# EAGLE design ssr-breakout2 (EAGLE 6.5.0)
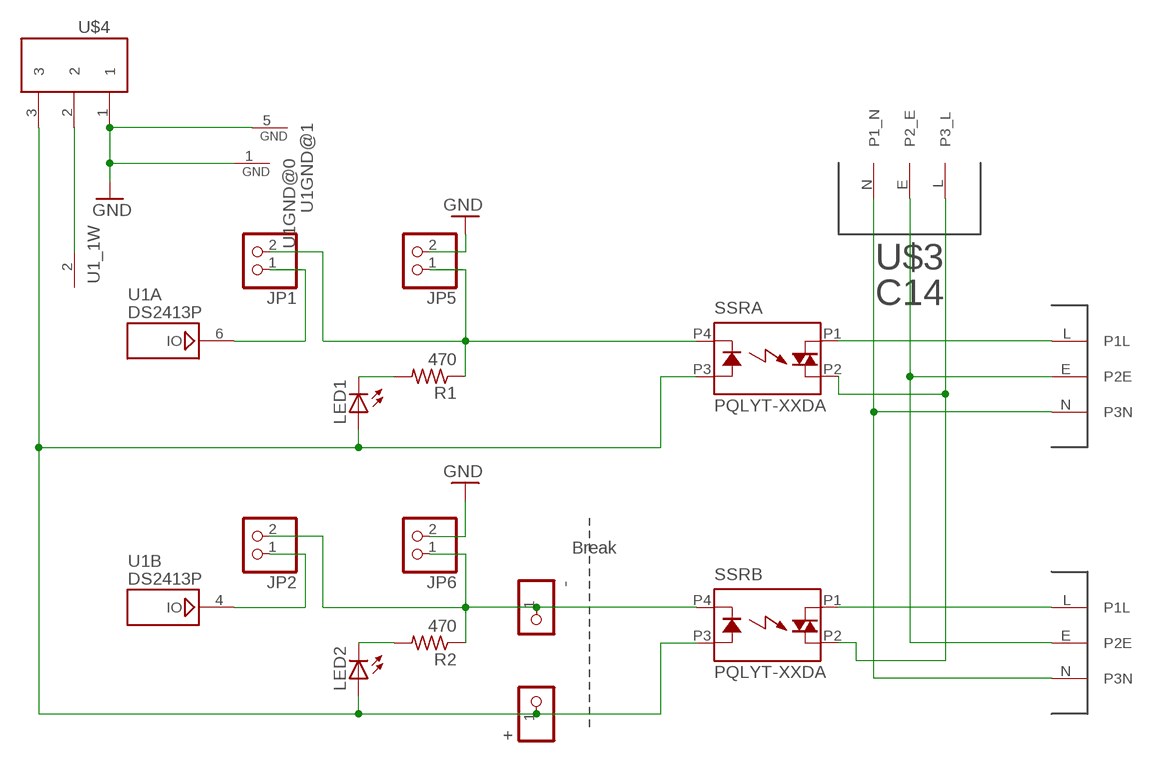
[diagram p0: schematic, sheet 1]

## Parts
+  PINHD-1X1CB  [1X01-CLEANBIG]
-  PINHD-1X1CB  [1X01-CLEANBIG]
JP1  PINHD-1X2  [1X02]
JP2  PINHD-1X2  [1X02]
JP5  PINHD-1X2  [1X02]
JP6  PINHD-1X2  [1X02]
LED1  LEDCHIPLED_0805  [CHIPLED_0805]
LED2  LEDCHIPLED_0805  [CHIPLED_0805]
R1  470  R-US_R0805  [R0805]
R2  470  R-US_R0805  [R0805]
SSRA  PQLYT-XXDA  [PQLYT]
SSRB  PQLYT-XXDA  [PQLYT]
U1  DS2413P  [TSOC6]
U$3  C14  [6ESRM-P]
U$4  3.5MM3PHORIZONTAL  [3.5MM3P]
U$5  C13  [PX0695/10/PC]
U$6  C13  [PX0695/10/PC]

## Nets
GND: JP5.2 JP6.2 U1.1 U1.5 U$4.1
N$2: LED1.C R1.2
N$3: LED2.C R2.2
N$4: -.1 JP2.2 JP6.1 R2.1 SSRB.P4(K)
N$5: +.1 LED1.A LED2.A SSRA.P3(A) SSRB.P3(A) U$4.3
N$6: SSRA.P1(DS1) U$5.L(P1L)
N$7: SSRA.P2(DS2) SSRB.P2(DS2) U$3.L(P3_L)
N$8: U1.2 U$4.2
N$9: U$3.E(P2_E) U$5.E(P2E) U$6.E(P2E)
N$10: SSRB.P1(DS1) U$6.L(P1L)
N$11: JP1.1 U1.6
N$12: JP2.1 U1.4
N$13: U$3.N(P1_N) U$5.N(P3N) U$6.N(P3N)
N$14: JP1.2 JP5.1 R1.1 SSRA.P4(K)

## Notes on the sheet
- Break

## Library data of the parts
+ - = adafruit:PINHD-1X1: Pin header 1x1 for 0.1" spacing With round pins
JP1 JP2 JP5 JP6 = pinhead:PINHD-1X2: PIN HEADER
LED1 LED2 = adafruit:LED: LED OSRAM: - CHIPLED LG R971, LG N971, LY N971, LG Q971, LY Q971, LO R971, LY R971 LH N974, LH R974 LS Q976, LO Q976, LY Q976 LO Q996 - Hyper CHIPLED LW Q18S LB Q993, LB Q99A, LB R99A - SideLED LS A670, LO A670, LY A670, LG A670, LP A670 LB A673, LV A673, LT A673, LW A673 LH A674 LY A675 LS A676, LA A676, LO A676, LY A676, LW A676 LS A679, LY A679, LG A679 - Hyper Micro SIDELED® LS Y876, LA Y876, LO Y876, LY Y876 LT Y87S - SmartLED LW L88C, LW L88S LB L89C, LB L89S, LG L890 LS L89K, LO L89K, LY L89K LS L896, LA L896, LO L896, LY L896 - TOPLED LS T670, LO T670, LY T670, LG T670, LP T670 LSG T670, LSP T670, LSY T670, LOP T670, LYG T670 LG T671, LOG T671, LSG T671 LB T673, LV T673, LT T673, LW T673 LH T674 LS T676, LA T676, LO T676, LY T676, LB T676, LH T676, LSB T676, LW T676 LB T67C, LV T67C, LT T67C, LS T67K, LO T67K, LY T67K, LW E67C LS E67B, LA E67B, LO E67B, LY E67B, LB E67C, LV E67C, LT E67C LW T67C LS T679, LY T679, LG T679 LS T770, LO T770, LY T770, LG T770, LP T770 LB T773, LV T773, LT T773, LW T773 LH T774 LS E675, LA E675, LY E675, LS T675 LS T776, LA T776, LO T776, LY T776, LB T776 LHGB T686 LT T68C, LB T68C - Hyper Mini TOPLED® LB M676 - Mini TOPLED Santana® LG M470 LS M47K, LO M47K, LY M47K Source: http://www.osram.convergy.de/
R1 R2 = adafruit:R-US_: RESISTOR, American symbol
SSRA SSRB = brewpi:PQLYT-XXDA
U1 = 1wire:DS2413: Dual Channel Addressable Switch This chip is similar to the DS2405 chip, but provides two PIO channels with 20mA sinking capability and an on-resistance of 20Ohm for each open drain output. Up to 28V can be switched. Note: Both GND pins must be connected to 0V. Author: Jan Kandziora <jjj@gmx.de>
U$3 = brewpi:C14
U$4 = elcojacobs:3.5MM3P
U$5 U$6 = brewpi:C13

## Board
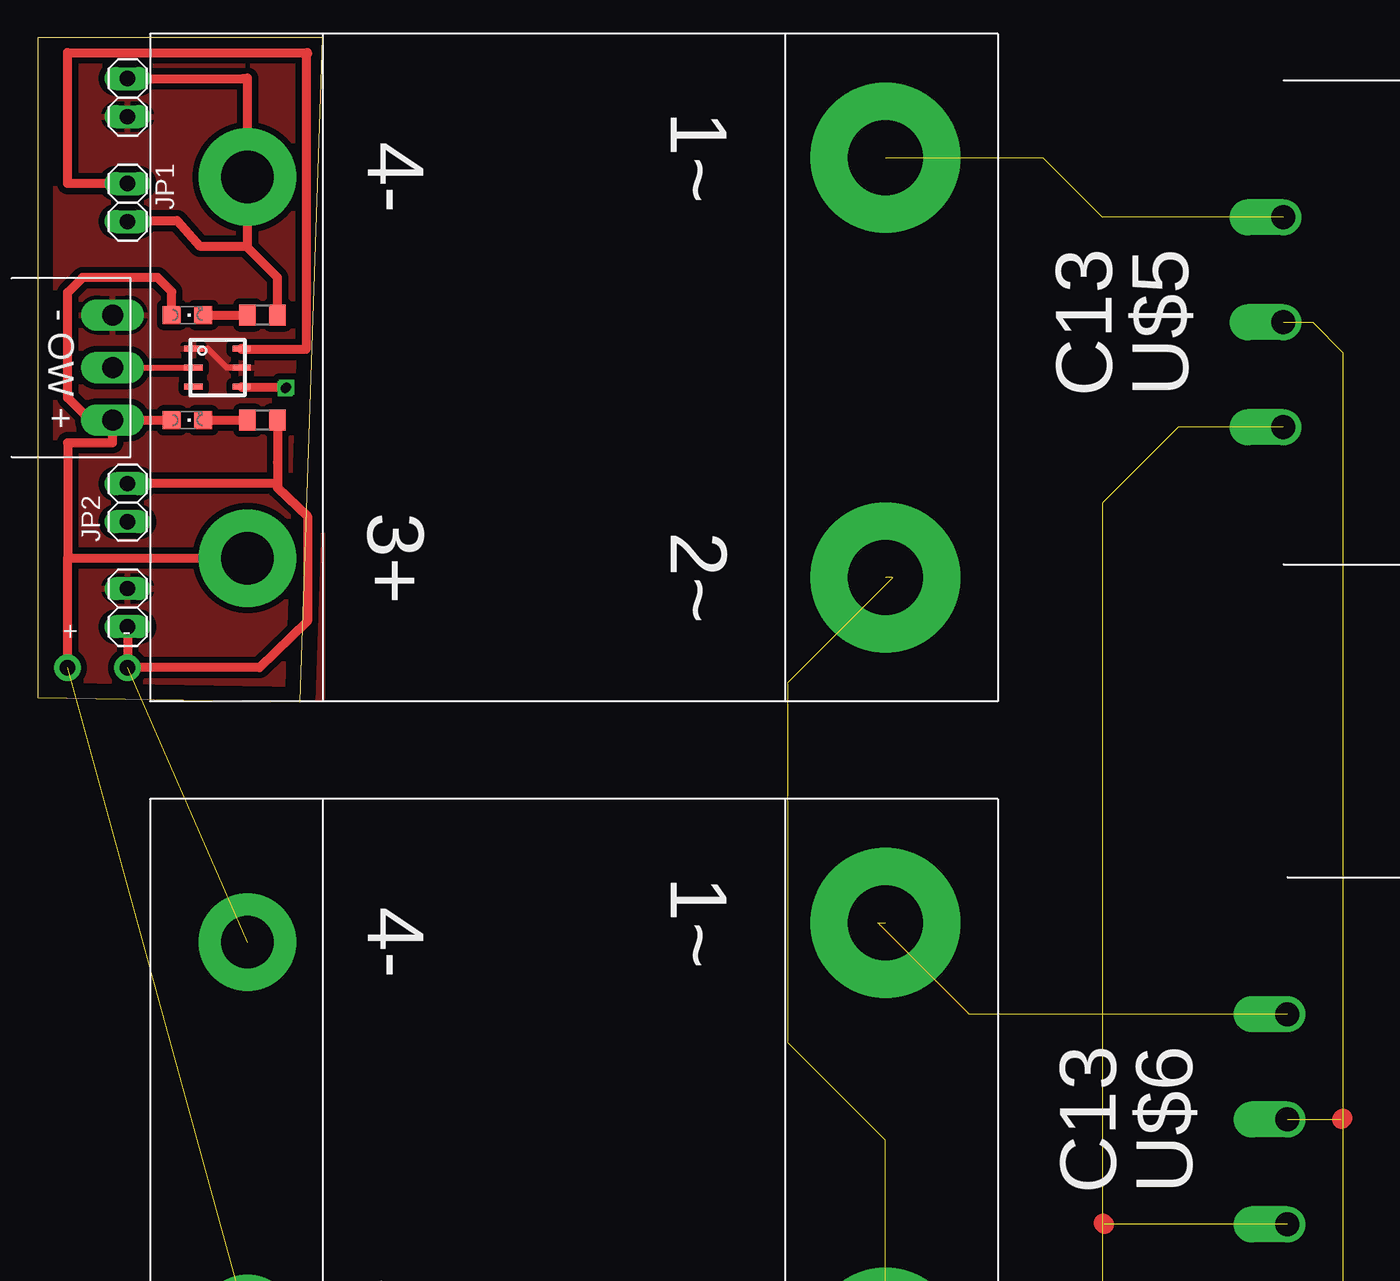
[diagram p1: board, top side]
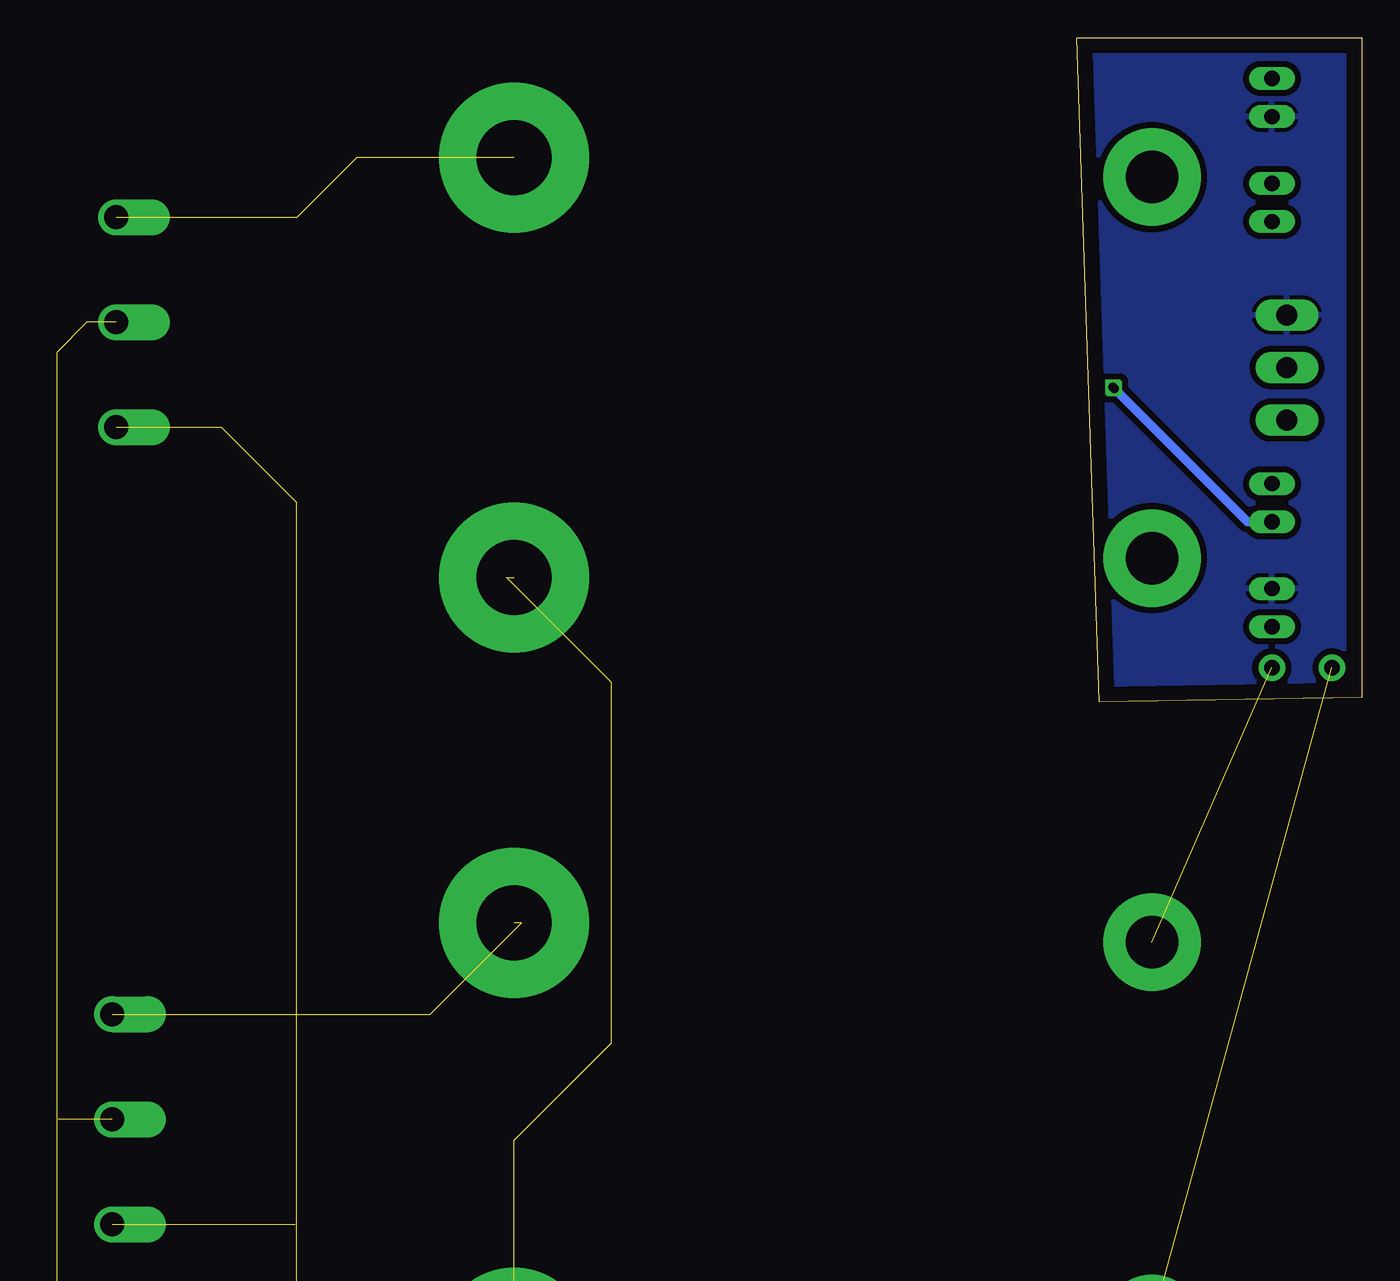
[diagram p2: board, bottom side, seen from below]

Size 19 x 44.3 mm. Coordinates in mm from the lower left corner, seen from the top.
Outline: 0,0.3 17.5,0 19,44.3 0,44.3 0,0.3
Copper layers (1*16): Top 0.035mm / dielectric 1.5mm / Bottom 0.035mm
Design rules "default": minimum track width 10mil, minimum drill 24mil, track to track 8mil, track to pad 8mil, pad to pad 8mil, via to via 8mil, smd to smd 8mil, copper to edge 40mil, drill to drill 8mil, minimum pad ring 10mil, minimum via ring 8mil, stop-mask expansion 4mil, vias tented up to drill 0mil, thermal gap 10mil

### Footprints (pad centres in the part's own frame; a part is rotated, then mirrored left to right if it is on the bottom)
1X01-CLEANBIG = drill 1.016 pad 1.778: 1 0,0
1X02 = drill 1.016 long: 1 -1.27,0; 2 1.27,0
CHIPLED_0805 = smd 1.2 x 1.2: A 0,-1.05; C 0,1.05
R0805 = smd 1.1 x 1.4: 1 -1,0; 2 1,0
PQLYT = drill 5 pad 10: P1 42.5,14; P2 42.5,-14 | drill 3.5 pad 6.5: P3 0,-12.7; P4 0,12.7
TSOC6 = smd 0.406 x 1.219: 1 -1.27,-1.6; 2 0,-1.6; 3 1.27,-1.6; 4 1.27,1.6; 5 0,1.6; 6 -1.27,1.6
6ESRM-P = drill 1.6 pad 3.81: E 0,0; L 9.144,0; N -9.144,0 | hole 3.404: 20.003,9.652; -20.003,9.652
3.5MM3P = drill 1.4 long: 1 -3.5,0; 2 0,0; 3 3.5,0
PX0695/10/PC = drill 1.6 offset: E 0,0; L -7,0; N 7,0

### Placement (x,y rotation side)
+  2,2.3 0 top
-  6,2.3 0 top
JP1  6,33.3 270 top
JP2  6,13.3 90 top
JP5  6,40.3 270 top
JP6  6,6.3 90 top
LED1  10,25.8 270 top
LED2  10,18.8 270 top
R1  15,25.8 180 top
R2  15,18.8 180 top
SSRA  14,22.3 0 top
SSRB  14,-28.7 0 top  (outside the outline)
U1  12,22.3 270 top
U$3  61.86,-60.16 180 top  (outside the outline)
U$4  5,22.3 270 top
U$5  83.03,25.32 270 top  (outside the outline)
U$6  83.3,-27.8 270 top  (outside the outline)

### Tracks (layer width: path | path; a pad name or v marks a point on that pad's centre or on a via)
GND
  Top 0.406: U1.5 12.6,22.3 11.33,23.57 U1.1
  pour Top (isolate 0.406): 0,0.3 19,0.3 19,44.3 0,44.3
  pour Bottom (isolate 0.406): -1,0.3 19,0.3 19,44.3 -1,44.3
N$1  (via drill 0.6)
  other vias: 16.5,20.9
N$2
  Top 0.61: LED1.C R1.2
N$3
  Top 0.61: LED2.C R2.2
N$4  (1 unrouted)
  Top 0.406: 16.07,15.93 16,16
  Top 0.61: R2.1 16,16 16,14.6 | 16,14.6 16,14.3 18,12.4 18,5.4 14.8,2.3 -.1 JP6.1 | 16,14.6 6,14.6 JP2.2
N$5  (1 unrouted)
  Top 0.61: U$4.3 LED2.A | LED1.A 8.95,27.35 8,28.3 3,28.3 2,27.3 2,20.3 3.5,18.8 U$4.3 | +.1 2,9.6 | 2,9.6 2,17.3 5,17.3 U$4.3 | 2,9.6 SSRA.P3
N$6  (3 unrouted)
N$7  (7 unrouted)
N$8
  Top 0.406: U$4.2 U1.2
N$9  (8 unrouted)
  Top 1.27: 86.9,-27.8 87,-27.7
N$10  (3 unrouted)
N$11
  Top 0.61: JP1.1 2,34.57 2,43.3 18,43.3 18,43.2 17.9,43.2 17.9,23.5 13.6,23.5 U1.6
N$12  (via drill 0.6)
  Top 0.61: U1.4 13.63,21 v16.6,21
  Bottom 0.61: v16.6,21 7.63,12.03 JP2.1
N$13  (5 unrouted)
  Top 1.27: 71.1,-34.8 71,-34.7
N$14
  Top 0.406: 16.07,28.27 16,28.3
  Top 0.61: 6,32.1 6.4,32.1 | 6.4,32.1 9.3,32.1 10.8,30.4 14,30.4 | R1.1 16,28.3 14,30.3 14,30.4 | 14,30.4 SSRA.P4 14,41.6 13.73,41.57 JP5.1 | JP1.2 6.4,32.03 6.4,32.1

### Text on the board
tPlace: - OW +